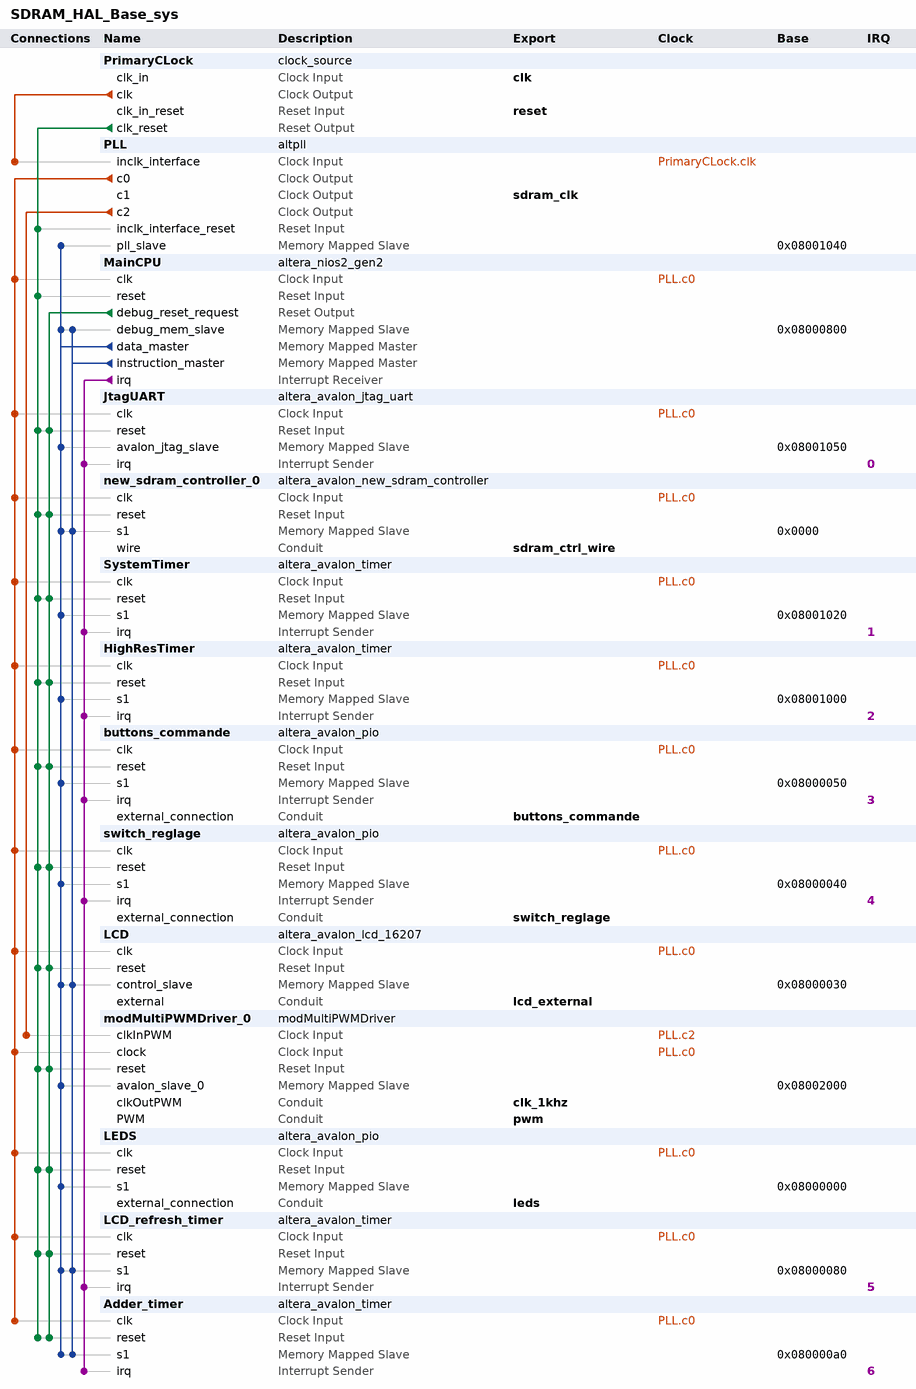
[diagram p0: system contents]
# Platform Designer (Qsys) system SDRAM_HAL_Base_sys, Cyclone IV E EP4CE115F29C7
# Parameters at their usual value, and those the tool derives, are not listed.
package require -exact qsys 17.1
create_system SDRAM_HAL_Base_sys
set_project_property DEVICE_FAMILY {Cyclone IV E}
set_project_property DEVICE EP4CE115F29C7

add_instance PrimaryCLock clock_source 17.1
set_instance_parameter_value PrimaryCLock clockFrequency 50000000

add_instance PLL altpll 17.1
set_instance_parameter_value PLL CLK0_DIVIDE_BY 1
set_instance_parameter_value PLL CLK0_MULTIPLY_BY 2
set_instance_parameter_value PLL CLK1_DIVIDE_BY 1
set_instance_parameter_value PLL CLK1_DUTY_CYCLE 50
set_instance_parameter_value PLL CLK1_MULTIPLY_BY 2
set_instance_parameter_value PLL CLK1_PHASE_SHIFT -1667
set_instance_parameter_value PLL CLK2_DIVIDE_BY 3125
set_instance_parameter_value PLL CLK2_DUTY_CYCLE 50
set_instance_parameter_value PLL CLK2_MULTIPLY_BY 64
set_instance_parameter_value PLL CLK2_PHASE_SHIFT 0
set_instance_parameter_value PLL INCLK0_INPUT_FREQUENCY 20000
set_instance_parameter_value PLL PORT_ARESET PORT_UNUSED
set_instance_parameter_value PLL PORT_LOCKED PORT_UNUSED
set_instance_parameter_value PLL PORT_clk1 PORT_USED
set_instance_parameter_value PLL PORT_clk2 PORT_USED
set_instance_parameter_value PLL PORT_clk3 PORT_UNUSED

add_instance MainCPU altera_nios2_gen2 17.1
set_instance_parameter_value MainCPU dcache_size 2048
set_instance_parameter_value MainCPU exceptionSlave new_sdram_controller_0.s1
set_instance_parameter_value MainCPU icache_size 4096
set_instance_parameter_value MainCPU impl Tiny
set_instance_parameter_value MainCPU resetSlave new_sdram_controller_0.s1

add_instance JtagUART altera_avalon_jtag_uart 17.1
set_instance_parameter_value JtagUART simInteractiveOptions NO_INTERACTIVE_WINDOWS

add_instance new_sdram_controller_0 altera_avalon_new_sdram_controller 17.1
set_instance_parameter_value new_sdram_controller_0 TAC 5.5
set_instance_parameter_value new_sdram_controller_0 TRCD 20.0
set_instance_parameter_value new_sdram_controller_0 TRP 20.0
set_instance_parameter_value new_sdram_controller_0 casLatency 3
set_instance_parameter_value new_sdram_controller_0 columnWidth 10
set_instance_parameter_value new_sdram_controller_0 dataWidth 32
set_instance_parameter_value new_sdram_controller_0 generateSimulationModel false
set_instance_parameter_value new_sdram_controller_0 model single_Micron_MT48LC4M32B2_7_chip
set_instance_parameter_value new_sdram_controller_0 numberOfBanks 4
set_instance_parameter_value new_sdram_controller_0 numberOfChipSelects 1
set_instance_parameter_value new_sdram_controller_0 powerUpDelay 200.0
set_instance_parameter_value new_sdram_controller_0 refreshPeriod 7.8125
set_instance_parameter_value new_sdram_controller_0 rowWidth 13

add_instance SystemTimer altera_avalon_timer 17.1
set_instance_parameter_value SystemTimer period 1
set_instance_parameter_value SystemTimer periodUnits MSEC

add_instance HighResTimer altera_avalon_timer 17.1
set_instance_parameter_value HighResTimer period 1
set_instance_parameter_value HighResTimer periodUnits USEC

add_instance buttons_commande altera_avalon_pio 17.1
set_instance_parameter_value buttons_commande captureEdge true
set_instance_parameter_value buttons_commande direction Input
set_instance_parameter_value buttons_commande edgeType ANY
set_instance_parameter_value buttons_commande generateIRQ true
set_instance_parameter_value buttons_commande irqType EDGE
set_instance_parameter_value buttons_commande width 3

add_instance switch_reglage altera_avalon_pio 17.1
set_instance_parameter_value switch_reglage captureEdge true
set_instance_parameter_value switch_reglage direction Input
set_instance_parameter_value switch_reglage edgeType ANY
set_instance_parameter_value switch_reglage generateIRQ true
set_instance_parameter_value switch_reglage irqType EDGE
set_instance_parameter_value switch_reglage width 1

add_instance LCD altera_avalon_lcd_16207 17.1

add_instance modMultiPWMDriver_0 modMultiPWMDriver 1.0
set_instance_parameter_value modMultiPWMDriver_0 NB_PWM 24
set_instance_parameter_value modMultiPWMDriver_0 RESOLUTION 10

add_instance LEDS altera_avalon_pio 17.1
set_instance_parameter_value LEDS direction Output
set_instance_parameter_value LEDS width 24

add_instance LCD_refresh_timer altera_avalon_timer 17.1
set_instance_parameter_value LCD_refresh_timer period 100
set_instance_parameter_value LCD_refresh_timer periodUnits MSEC

add_instance Adder_timer altera_avalon_timer 17.1
set_instance_parameter_value Adder_timer period 250
set_instance_parameter_value Adder_timer periodUnits MSEC

# connections
add_connection PLL.c0 Adder_timer.clk clock
add_connection PLL.c0 buttons_commande.clk clock
add_connection PLL.c0 HighResTimer.clk clock
add_connection PLL.c0 JtagUART.clk clock
add_connection PLL.c0 LCD.clk clock
add_connection PLL.c0 LCD_refresh_timer.clk clock
add_connection PLL.c0 LEDS.clk clock
add_connection PLL.c0 MainCPU.clk clock
add_connection PLL.c0 modMultiPWMDriver_0.clock clock
add_connection PLL.c0 new_sdram_controller_0.clk clock
add_connection PLL.c0 switch_reglage.clk clock
add_connection PLL.c0 SystemTimer.clk clock
add_connection PLL.c2 modMultiPWMDriver_0.clkInPWM clock
add_connection PrimaryCLock.clk PLL.inclk_interface clock
add_connection MainCPU.debug_reset_request Adder_timer.reset reset
add_connection MainCPU.debug_reset_request buttons_commande.reset reset
add_connection MainCPU.debug_reset_request HighResTimer.reset reset
add_connection MainCPU.debug_reset_request JtagUART.reset reset
add_connection MainCPU.debug_reset_request LCD.reset reset
add_connection MainCPU.debug_reset_request LCD_refresh_timer.reset reset
add_connection MainCPU.debug_reset_request LEDS.reset reset
add_connection MainCPU.debug_reset_request modMultiPWMDriver_0.reset reset
add_connection MainCPU.debug_reset_request new_sdram_controller_0.reset reset
add_connection MainCPU.debug_reset_request switch_reglage.reset reset
add_connection MainCPU.debug_reset_request SystemTimer.reset reset
add_connection PrimaryCLock.clk_reset Adder_timer.reset reset
add_connection PrimaryCLock.clk_reset buttons_commande.reset reset
add_connection PrimaryCLock.clk_reset HighResTimer.reset reset
add_connection PrimaryCLock.clk_reset JtagUART.reset reset
add_connection PrimaryCLock.clk_reset LCD.reset reset
add_connection PrimaryCLock.clk_reset LCD_refresh_timer.reset reset
add_connection PrimaryCLock.clk_reset LEDS.reset reset
add_connection PrimaryCLock.clk_reset MainCPU.reset reset
add_connection PrimaryCLock.clk_reset modMultiPWMDriver_0.reset reset
add_connection PrimaryCLock.clk_reset new_sdram_controller_0.reset reset
add_connection PrimaryCLock.clk_reset PLL.inclk_interface_reset reset
add_connection PrimaryCLock.clk_reset switch_reglage.reset reset
add_connection PrimaryCLock.clk_reset SystemTimer.reset reset
add_connection MainCPU.data_master Adder_timer.s1 avalon
set_connection_parameter_value MainCPU.data_master/Adder_timer.s1 baseAddress 0x080000a0
add_connection MainCPU.data_master buttons_commande.s1 avalon
set_connection_parameter_value MainCPU.data_master/buttons_commande.s1 baseAddress 0x08000050
add_connection MainCPU.data_master HighResTimer.s1 avalon
set_connection_parameter_value MainCPU.data_master/HighResTimer.s1 baseAddress 0x08001000
add_connection MainCPU.data_master JtagUART.avalon_jtag_slave avalon
set_connection_parameter_value MainCPU.data_master/JtagUART.avalon_jtag_slave baseAddress 0x08001050
add_connection MainCPU.data_master LCD.control_slave avalon
set_connection_parameter_value MainCPU.data_master/LCD.control_slave baseAddress 0x08000030
add_connection MainCPU.data_master LCD_refresh_timer.s1 avalon
set_connection_parameter_value MainCPU.data_master/LCD_refresh_timer.s1 baseAddress 0x08000080
add_connection MainCPU.data_master LEDS.s1 avalon
set_connection_parameter_value MainCPU.data_master/LEDS.s1 baseAddress 0x08000000
add_connection MainCPU.data_master MainCPU.debug_mem_slave avalon
set_connection_parameter_value MainCPU.data_master/MainCPU.debug_mem_slave baseAddress 0x08000800
add_connection MainCPU.data_master modMultiPWMDriver_0.avalon_slave_0 avalon
set_connection_parameter_value MainCPU.data_master/modMultiPWMDriver_0.avalon_slave_0 baseAddress 0x08002000
add_connection MainCPU.data_master new_sdram_controller_0.s1 avalon
set_connection_parameter_value MainCPU.data_master/new_sdram_controller_0.s1 baseAddress 0x0000
add_connection MainCPU.data_master PLL.pll_slave avalon
set_connection_parameter_value MainCPU.data_master/PLL.pll_slave baseAddress 0x08001040
add_connection MainCPU.data_master switch_reglage.s1 avalon
set_connection_parameter_value MainCPU.data_master/switch_reglage.s1 baseAddress 0x08000040
add_connection MainCPU.data_master SystemTimer.s1 avalon
set_connection_parameter_value MainCPU.data_master/SystemTimer.s1 baseAddress 0x08001020
add_connection MainCPU.instruction_master Adder_timer.s1 avalon
set_connection_parameter_value MainCPU.instruction_master/Adder_timer.s1 baseAddress 0x080000a0
add_connection MainCPU.instruction_master LCD.control_slave avalon
set_connection_parameter_value MainCPU.instruction_master/LCD.control_slave baseAddress 0x08000030
add_connection MainCPU.instruction_master LCD_refresh_timer.s1 avalon
set_connection_parameter_value MainCPU.instruction_master/LCD_refresh_timer.s1 baseAddress 0x08000080
add_connection MainCPU.instruction_master MainCPU.debug_mem_slave avalon
set_connection_parameter_value MainCPU.instruction_master/MainCPU.debug_mem_slave baseAddress 0x08000800
add_connection MainCPU.instruction_master new_sdram_controller_0.s1 avalon
set_connection_parameter_value MainCPU.instruction_master/new_sdram_controller_0.s1 baseAddress 0x0000
add_connection MainCPU.irq Adder_timer.irq interrupt
set_connection_parameter_value MainCPU.irq/Adder_timer.irq irqNumber 6
add_connection MainCPU.irq buttons_commande.irq interrupt
set_connection_parameter_value MainCPU.irq/buttons_commande.irq irqNumber 3
add_connection MainCPU.irq HighResTimer.irq interrupt
set_connection_parameter_value MainCPU.irq/HighResTimer.irq irqNumber 2
add_connection MainCPU.irq JtagUART.irq interrupt
set_connection_parameter_value MainCPU.irq/JtagUART.irq irqNumber 0
add_connection MainCPU.irq LCD_refresh_timer.irq interrupt
set_connection_parameter_value MainCPU.irq/LCD_refresh_timer.irq irqNumber 5
add_connection MainCPU.irq switch_reglage.irq interrupt
set_connection_parameter_value MainCPU.irq/switch_reglage.irq irqNumber 4
add_connection MainCPU.irq SystemTimer.irq interrupt
set_connection_parameter_value MainCPU.irq/SystemTimer.irq irqNumber 1

# exported interfaces
add_interface buttons_commande conduit end
set_interface_property buttons_commande EXPORT_OF buttons_commande.external_connection
add_interface clk clock sink
set_interface_property clk EXPORT_OF PrimaryCLock.clk_in
add_interface clk_1khz conduit end
set_interface_property clk_1khz EXPORT_OF modMultiPWMDriver_0.clkOutPWM
add_interface lcd_external conduit end
set_interface_property lcd_external EXPORT_OF LCD.external
add_interface leds conduit end
set_interface_property leds EXPORT_OF LEDS.external_connection
add_interface pwm conduit end
set_interface_property pwm EXPORT_OF modMultiPWMDriver_0.PWM
add_interface reset reset sink
set_interface_property reset EXPORT_OF PrimaryCLock.clk_in_reset
add_interface sdram_clk clock source
set_interface_property sdram_clk EXPORT_OF PLL.c1
add_interface sdram_ctrl_wire conduit end
set_interface_property sdram_ctrl_wire EXPORT_OF new_sdram_controller_0.wire
add_interface switch_reglage conduit end
set_interface_property switch_reglage EXPORT_OF switch_reglage.external_connection

set_interconnect_requirement {$system} qsys_mm.clockCrossingAdapter HANDSHAKE
set_interconnect_requirement {$system} qsys_mm.enableEccProtection FALSE
set_interconnect_requirement {$system} qsys_mm.insertDefaultSlave FALSE
set_interconnect_requirement {$system} qsys_mm.maxAdditionalLatency 1

save_system SDRAM_HAL_Base_sys.qsys
